# EasyEDA schematic Now Communicator Apr 17 2026.json

## Sheets
1 Sheet_1: TITLE: Sheet_1; REV: 1.0; Date: 2026-03-22; Sheet: 1/1; Drawn By: capyvara0; Company: Your Company
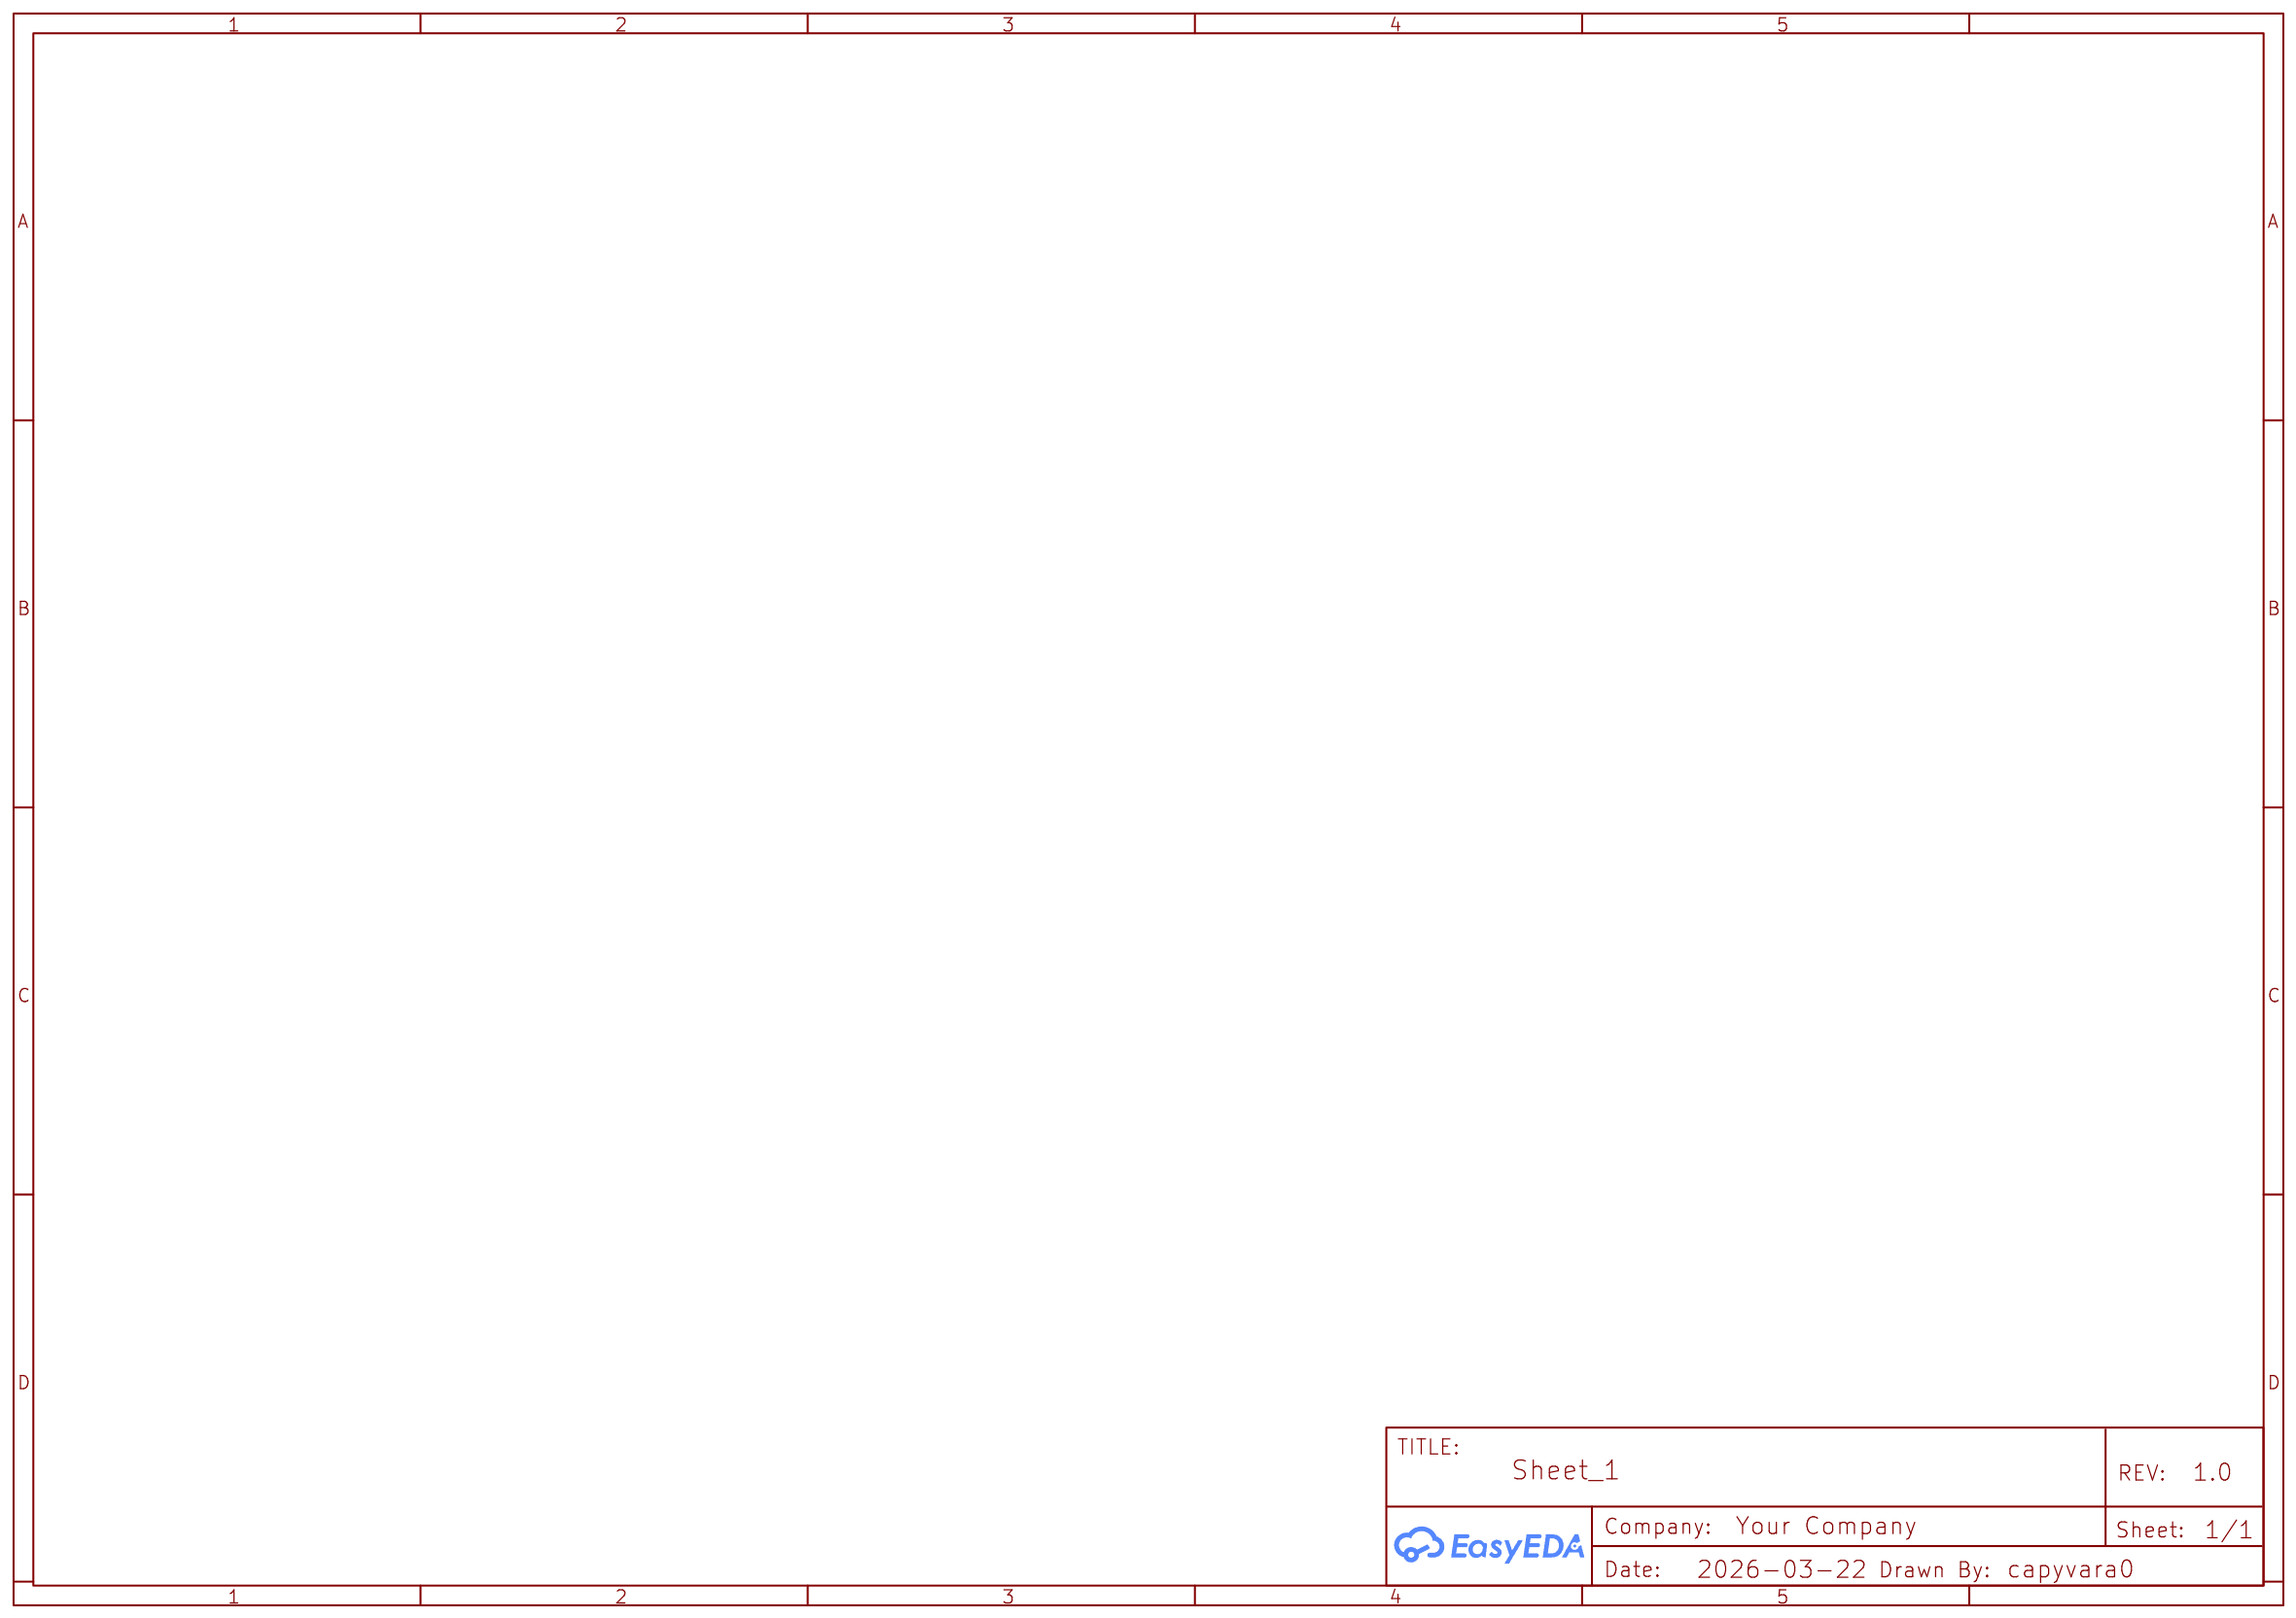
[diagram p0: Sheet_1]
2 Sheet_3: Date: 2026-03-18
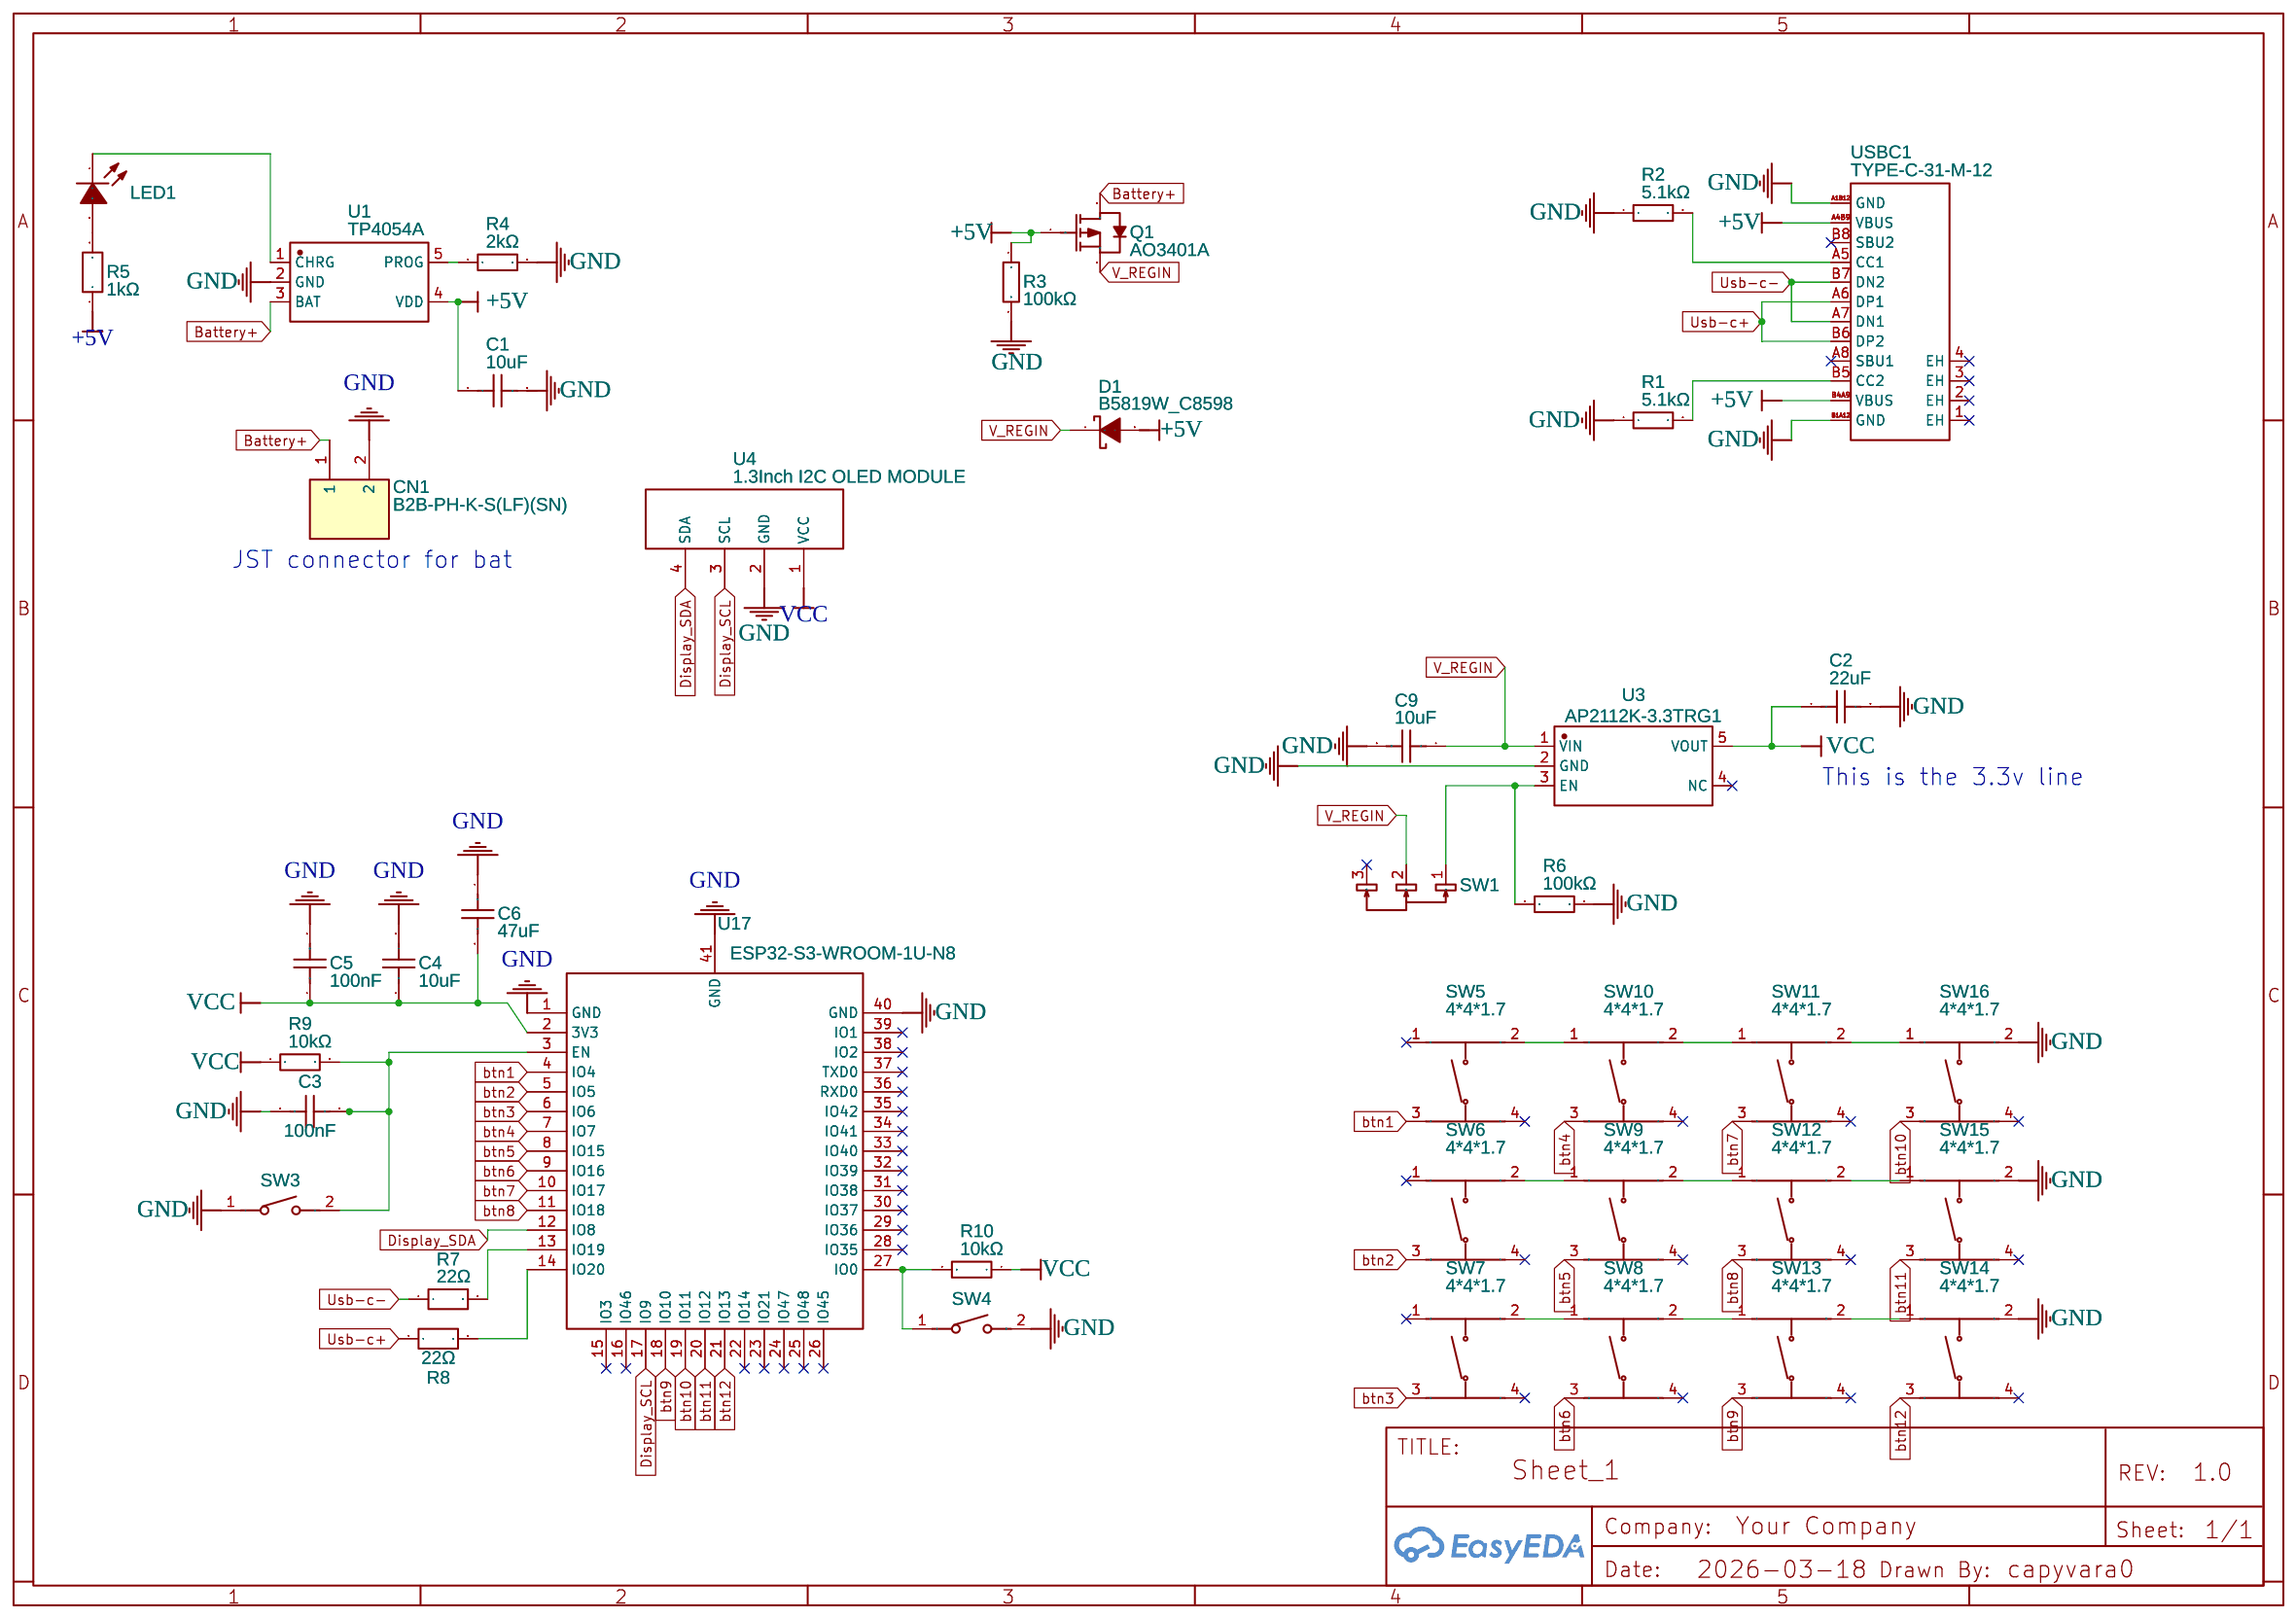
[diagram p1: Sheet_3]

## Parts
C1  10uF  [C0603]
C2  22uF  [C0603]
C3  100nF  [C0603]
C4  10uF  [C0805]
C5  100nF  [C0805]
C6  47uF  [C0805]
C9  10uF  [C0603]
CN1  B2B-PH-K-S(LF)(SN)  [CONN-TH_B2B-PH-K-S]
D1  B5819W_C8598  [SOD-123_L2.7-W1.6-LS3.7-RD-1]
LED1  FC-2012HRK-620D  [LED0805-RD]
Q1  AO3401A  [SOT-23_L2.9-W1.3-P1.90-LS2.4-BR]
R1  5.1kΩ  [R0603]
R2  5.1kΩ  [R0603]
R3  100kΩ  [R0603]
R4  2kΩ  [R0603]
R5  1kΩ  [R0805]
R6  100kΩ  [R0805]
R7  22Ω  [R0603]
R8  22Ω  [R0603]
R9  10kΩ  [R0603]
R10  10kΩ  [R0603]
SW1  MST-12D18G4 SPDT SLIDE SWITCH  [SW-SMD_MST-12D18G4-SPDT-SLIDE-SWITCH]
SW3  TS-1088-AR02016  [SW-SMD_L3.9-W3.0-P4.45]
SW4  TS-1088-AR02016  [SW-SMD_L3.9-W3.0-P4.45]
SW5  4*4*1.7  [SW-SMD_4P-L5.2-W5.2-P3.70-LS6.5]
SW6  4*4*1.7  [SW-SMD_4P-L5.2-W5.2-P3.70-LS6.5]
SW7  4*4*1.7  [SW-SMD_4P-L5.2-W5.2-P3.70-LS6.5]
SW8  4*4*1.7  [SW-SMD_4P-L5.2-W5.2-P3.70-LS6.5]
SW9  4*4*1.7  [SW-SMD_4P-L5.2-W5.2-P3.70-LS6.5]
SW10  4*4*1.7  [SW-SMD_4P-L5.2-W5.2-P3.70-LS6.5]
SW11  4*4*1.7  [SW-SMD_4P-L5.2-W5.2-P3.70-LS6.5]
SW12  4*4*1.7  [SW-SMD_4P-L5.2-W5.2-P3.70-LS6.5]
SW13  4*4*1.7  [SW-SMD_4P-L5.2-W5.2-P3.70-LS6.5]
SW14  4*4*1.7  [SW-SMD_4P-L5.2-W5.2-P3.70-LS6.5]
SW15  4*4*1.7  [SW-SMD_4P-L5.2-W5.2-P3.70-LS6.5]
SW16  4*4*1.7  [SW-SMD_4P-L5.2-W5.2-P3.70-LS6.5]
U1  TP4054A  [SOT-23-5_L2.9-W1.6-P0.95-LS2.8-TL]
U3  AP2112K-3.3TRG1  [SOT-25-5_L2.9-W1.6-P0.95-LS2.8-BL]
U4  1.3Inch I2C OLED MODULE  [OLED 1.3 INCH]
U17  ESP32-S3-WROOM-1U-N8  [WIRELM-SMD_ESP32-S3-WROOM-1U]
USBC1  TYPE-C-31-M-12  [USB-C_SMD-TYPE-C-31-M-12_1]

## Library data of the parts
C1 C9 = CL10A106KP8NNNC: Supplier: LCSC; Manufacturer: SAMSUNG(三星); Supplier Part: C19702; JLCPCB Part Class: Basic Part
C2 = CL10A226MQ8NRNC: Supplier: LCSC; Manufacturer: SAMSUNG(三星); Supplier Part: C59461; JLCPCB Part Class: Basic Part
C3 = VJ0603Y104JXQCW1BC: Supplier: LCSC; Supplier Part: C3834925; Manufacturer: VISHAY(威世); JLCPCB Part Class: Extended Part; Contributor: lcsc
C4 = CL21A106KAYNNNE: Supplier: LCSC; Manufacturer: SAMSUNG(三星); Supplier Part: C15850; JLCPCB Part Class: Basic Part
C5 = CC0805KRX7R9BB104: Supplier: LCSC; Manufacturer: YAGEO(国巨); Supplier Part: C49678; JLCPCB Part Class: Basic Part
C6 = C0805X5R476M100NT: Contributor: LCSC; Supplier: LCSC; Supplier Part: C466799; Manufacturer: SANYEAR(叁叶源); JLCPCB Part Class: Extended Part
CN1 = B2B-PH-K-S(LF)(SN): Contributor: LCSC; Supplier: LCSC; Manufacturer: JST; Supplier Part: C131337; JLCPCB Part Class: Extended Part
D1 = B5819W_C8598: Supplier: LCSC; Manufacturer: CJ(江苏长电/长晶); Manufacturer Part: B5819W SL; Supplier Part: C8598; JLCPCB Part Class: Basic Part
LED1 = FC-2012HRK-620D: Supplier: LCSC; Manufacturer: 国星光电; Manufacturer Part: NCD0805R1; Supplier Part: C84256; JLCPCB Part Class: Basic Part
Q1 = AO3401A: Supplier: LCSC; Manufacturer: AOS; Supplier Part: C15127; JLCPCB Part Class: Basic Part
R1 R2 = 0603WAF5101T5E: Supplier: LCSC; Manufacturer: UNI-ROYAL(厚声); Supplier Part: C23186; JLCPCB Part Class: Basic Part
R3 = 0603WAF1003T5E: Supplier: LCSC; Manufacturer: UNI-ROYAL(厚声); Supplier Part: C25803; JLCPCB Part Class: Basic Part
R4 = 0603WAF2001T5E: Supplier: LCSC; Manufacturer: UNI-ROYAL(厚声); Supplier Part: C22975; JLCPCB Part Class: Basic Part
R5 = FRR0805J102 TS: Supplier: LCSC; Supplier Part: C49196827; Manufacturer: FOJAN(富捷); JLCPCB Part Class: Extended Part; Contributor: lcsc
R6 = 0805W8F1003T5E_C149504: Contributor: LCSC; Supplier: LCSC; Supplier Part: C149504; Manufacturer: UNI-ROYAL(厚声); Manufacturer Part: 0805W8F1003T5E; JLCPCB Part Class: Basic Part
R7 R8 = FRC0603F22R0TS: Supplier: LCSC; Supplier Part: C2930077; Manufacturer: FOJAN(富捷); JLCPCB Part Class: Extended Part; Contributor: lcsc
R9 R10 = 0603WAF1002T5E: Supplier: LCSC; Manufacturer: UNI-ROYAL(厚声); Supplier Part: C25804; JLCPCB Part Class: Basic Part
SW1 = MST-12D18G4 SPDT SLIDE SWITCH: Supplier: LCSC; Supplier Part: C49023767; Manufacturer: SHOU HAN(首韩); Manufacturer Part: MST-12D18G4 SPDT Slide Switch; JLCPCB Part Class: Extended Part; Contributor: lcsc
SW3 SW4 = TS-1088-AR02016: Contributor: LCSC; Supplier: LCSC; Supplier Part: C720477; Manufacturer: XUNPU(讯普); JLCPCB Part Class: Basic Part
SW5-SW16 = 4*4*1.7: Contributor: LCSC; Supplier: LCSC; Supplier Part: C10852; Manufacturer: BOOMELE(博穆精密); Manufacturer Part: 4*4*1.7 贴片; JLCPCB Part Class: Extended Part
U1 = TP4054A: Supplier: LCSC; Supplier Part: C33551022; Manufacturer: YONGYUTAI(永裕泰); JLCPCB Part Class: Extended Part; Contributor: lcsc
U3 = AP2112K-3.3TRG1: Contributor: LCSC; Supplier: LCSC; Manufacturer: DIODES(美台); Supplier Part: C51118; JLCPCB Part Class: Extended Part
U4 = 1.3Inch I2C OLED MODULE: Contributor: 손용훈
U17 = ESP32-S3-WROOM-1U-N8: Contributor: LCSC; Supplier: LCSC; Supplier Part: C2980297; Manufacturer: ESPRESSIF(乐鑫); JLCPCB Part Class: Extended Part
USBC1 = TYPE-C-31-M-12: Contributor: LCSC; Supplier: LCSC; Supplier Part: C165948; Manufacturer: 韩国韩荣; JLCPCB Part Class: Extended Part

## Nets
+5V: C1.1 D1.2(+) Q1.1(G) R3.1 R5.1 U1.4(VDD) USBC1.A4B9(VBUS) USBC1.B4A9(VBUS)
GND: C1.2 C2.2 C3.1 C4.2 C5.2 C6.1 C9.2 CN1.2 R1.1 R2.1 R3.2 R4.2 R6.2 SW3.1 SW4.2 SW14.2 SW15.2 SW16.2 U1.2(GND) U3.2(GND) U4.2(GND) U17.1(GND) U17.40(GND) U17.41(GND) USBC1.A1B12(GND) USBC1.B1A12(GND)
VCC: C2.1 C4.1 C5.1 C6.2 R9.1 R10.1 U3.5(VOUT) U4.1(VCC) U17.2(3V3)
Battery+: CN1.1 Q1.3(D) U1.3(BAT)
btn1: SW5.3 U17.4(IO4)
btn2: SW6.3 U17.5(IO5)
btn3: SW7.3 U17.6(IO6)
btn4: SW10.3 U17.7(IO7)
btn5: SW9.3 U17.8(IO15)
btn6: SW8.3 U17.9(IO16)
btn7: SW11.3 U17.10(IO17)
btn8: SW12.3 U17.11(IO18)
btn9: SW13.3 U17.18(IO10)
btn10: SW16.3 U17.19(IO11)
btn11: SW15.3 U17.20(IO12)
btn12: SW14.3 U17.21(IO13)
Display_SCL: U4.3(SCL) U17.17(IO9)
Display_SDA: U4.4(SDA) U17.12(IO8)
Usb-c+: R8.1 USBC1.A6(DP1) USBC1.B6(DP2)
Usb-c-: R7.1 USBC1.A7(DN1) USBC1.B7(DN2)
V_REGIN: C9.1 D1.1(-) Q1.2(S) SW1.2 U3.1(VIN)
Net-(C3-2): C3.2 R9.2 SW3.2 U17.3(EN)
Net-(LED1-1): LED1.1(-) U1.1(CHRG)
Net-(LED1-2): LED1.2(+) R5.2
Net-(R1-2): R1.2 USBC1.B5(CC2)
Net-(R2-2): R2.2 USBC1.A5(CC1)
Net-(R4-1): R4.1 U1.5(PROG)
Net-(R6-1): R6.1 SW1.1 U3.3(EN)
Net-(R7-2): R7.2 U17.13(IO19)
Net-(R8-2): R8.2 U17.14(IO20)
Net-(R10-2): R10.2 SW4.1 U17.27(IO0)
Net-(SW5-2): SW5.2 SW10.1
Net-(SW6-2): SW6.2 SW9.1
Net-(SW7-2): SW7.2 SW8.1
Net-(SW8-2): SW8.2 SW13.1
Net-(SW9-2): SW9.2 SW12.1
Net-(SW10-2): SW10.2 SW11.1
Net-(SW11-2): SW11.2 SW16.1
Net-(SW12-2): SW12.2 SW15.1
Net-(SW13-2): SW13.2 SW14.1

Not connected (* = marked no-connect by the designer): SW1 3*; SW5 1* 4*; SW6 1* 4*; SW7 1* 4*; SW8 4*; SW9 4*; SW10 4*; SW11 4*; SW12 4*; SW13 4*; SW14 4*; SW15 4*; SW16 4*; U3 4(NC)*; U17 15(IO3)* 16(IO46)* 22(IO14)* 23(IO21)* 24(IO47)* 25(IO48)* 26(IO45)* 28(IO35)* 29(IO36)* 30(IO37)* 31(IO38)* 32(IO39)* 33(IO40)* 34(IO41)* 35(IO42)* 36(RXD0)* 37(TXD0)* 38(IO2)* 39(IO1)*; USBC1 1(EH)* 2(EH)* 3(EH)* 4(EH)* A8(SBU1)* B8(SBU2)*

## Notes on the sheets
sheet 2
- JST connector for bat
- This is the 3.3v line
